# EasyEDA schematic SCH_rocket_competetion_2025-11-04.json
TITLE: IN-SPACe Rocket Schematic; REV: 1.0; Date: 2025-08-19; Sheet: 1/1; Drawn By: Riya; Company: TEAM SUDARSHAN
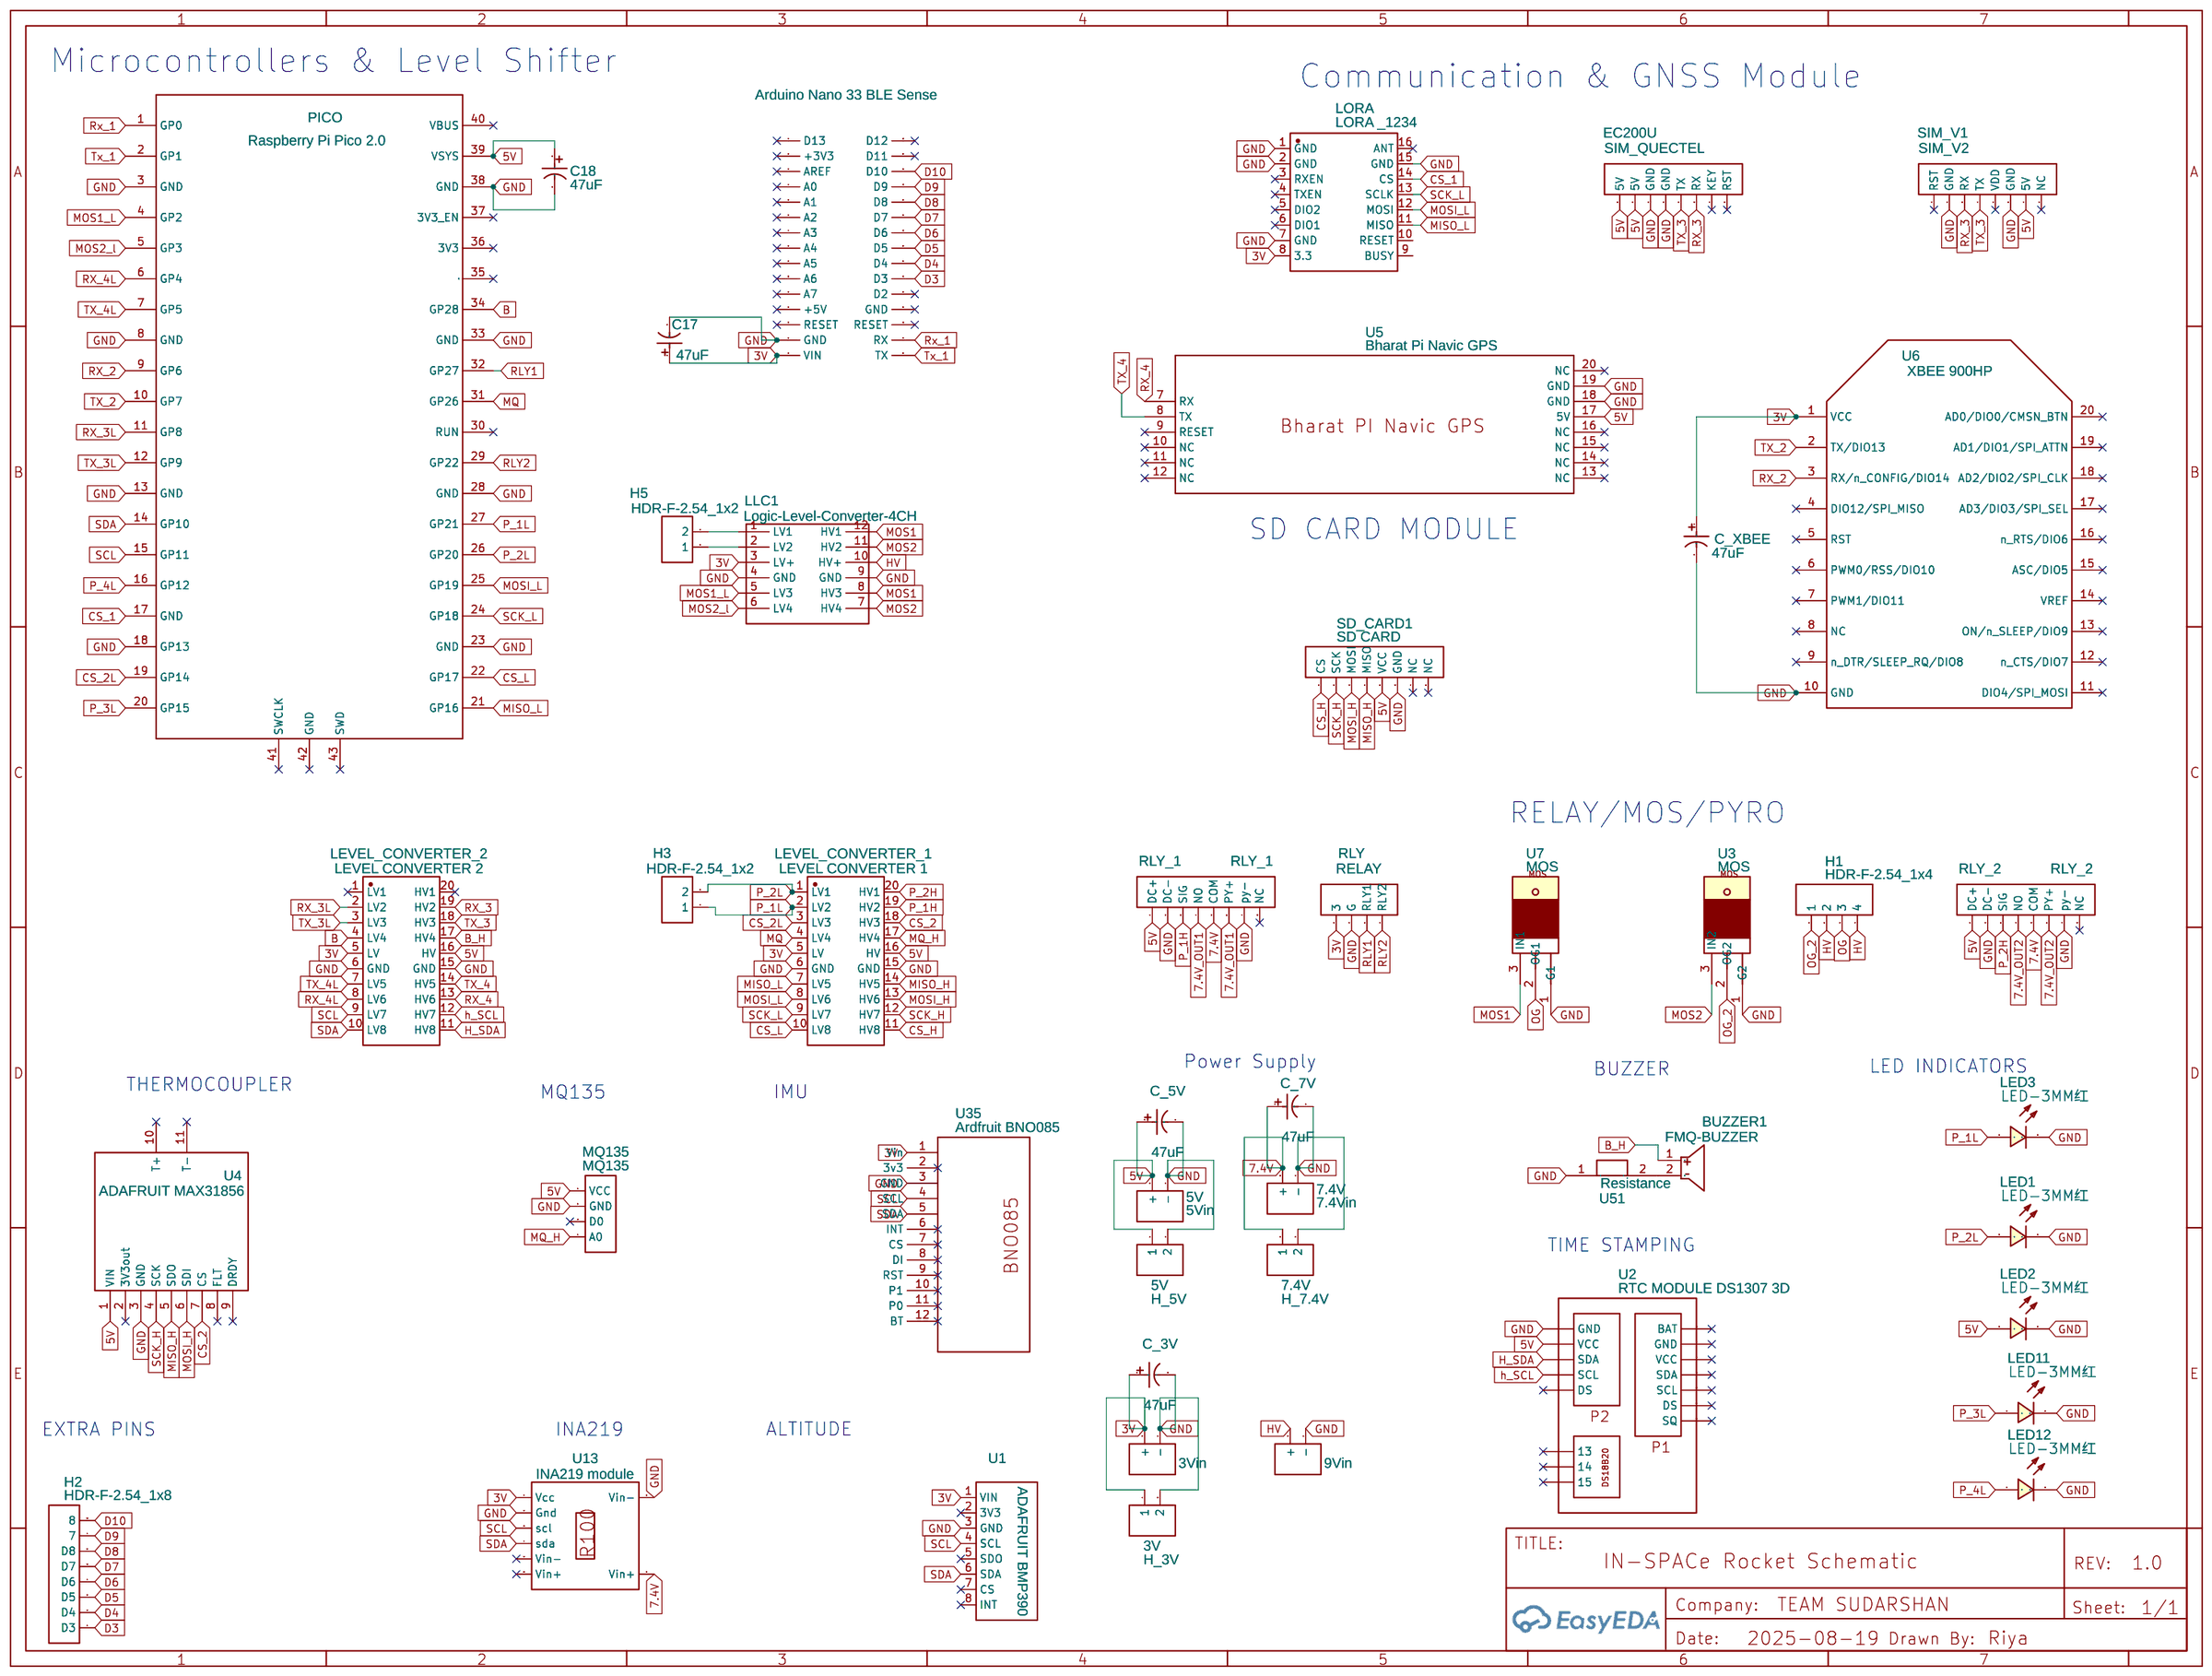
[diagram p0: schematic sheet]

## Parts
3.3V  3Vin  [CONN-TH_2P-P5.00]
5V  5Vin  [CONN-TH_2P-P5.00]
7.4V  7.4Vin  [CONN-TH_2P-P5.00]
9V  9Vin  [CONN-TH_2P-P5.00]
BLE33  Arduino Nano 33 BLE Sense  [ARDUINO_NANO_33_BLE_SENSE]
BUZZER1  FMQ-BUZZER  [BUZ-TH_BD12.0-P7.60-D0.6-FD]
C17  47uF  [CAPACITOR, 100UF 2.54MM PIN CAPACITOR]
C18  47uF  [CAPACITOR, 100UF 2.54MM PIN CAPACITOR]
C_3V  47uF  [CAPACITOR, 100UF 2.54MM PIN CAPACITOR]
C_5V  47uF  [CAPACITOR, 100UF 2.54MM PIN CAPACITOR]
C_7V  47uF  [CAPACITOR, 100UF 2.54MM PIN CAPACITOR]
C_XBEE  47uF  [CAPACITOR, 100UF 2.54MM PIN CAPACITOR]
EC200U  SIM_QUECTEL  [HDR-F-2.54_1X8]
H1  HDR-F-2.54_1x4  [HDR-F-2.54_1X4]
H2  HDR-F-2.54_1x8  [HDR-F-2.54_1X8]
H3  HDR-F-2.54_1x2  [HDR-F-2.54_1X2]
H5  HDR-F-2.54_1x2  [HDR-F-2.54_1X2]
H_3V  3V  [HDR-F-2.54_1X2]
H_5V  5V  [HDR-F-2.54_1X2]
H_7.4V  7.4V  [HDR-F-2.54_1X2]
LED1  LED-3MM红  [LED-TH_LED-3MM_RED]
LED2  LED-3MM红  [LED-TH_LED-3MM_RED]
LED3  LED-3MM红  [LED-TH_LED-3MM_RED]
LED11  LED-3MM红  [LED-TH_LED-3MM_RED]
LED12  LED-3MM红  [LED-TH_LED-3MM_RED]
LEVEL_CONVERTER_1  LEVEL CONVERTER 1  [MPN-TH-20_L28.0-W14.0-P2.54-BL]
LEVEL_CONVERTER_2  LEVEL CONVERTER 2  [MPN-TH-20_L28.0-W14.0-P2.54-BL]
LLC1  Logic-Level-Converter-4CH  [LOGIC-LEVEL-CONVERTER-4CH]
LORA  LORA _1234  [LORA_SX1262]
MQ135  MQ135  [HDR-F-2.54_1X4]
PICO  Raspberry Pi Pico 2.0  [PICO_FOOTPRINT_BY_HIMESH 2.0]
RLY  RELAY  [HDR-F-2.54_1X4]
RLY_1  RLY_1  [HDR-F-2.54_1X8]
RLY_2  RLY_2  [HDR-F-2.54_1X8]
SD_CARD1  SD CARD  [HDR-F-2.54_1X8]
SIM_V1  SIM_V2  [HDR-F-2.54_1X8]
U1  ADAFRUIT BMP390  [ADAFRUIT BMP390 NO HOLES]
U2  RTC MODULE DS1307 3D  [FP_RTC-MODULE-DS1307]
U3  MOS  [MOSFETIR540]
U4  ADAFRUIT MAX31856  [ADAFRUIT_MAX31856_BREAKOUT]
U5  Bharat Pi Navic GPS  [BHARAT PI NAVIC GPS]
U6  XBEE 900HP  [XBEE_PRO_S2C_THT]
U7  MOS  [MOSFETIR540]
U13  INA219 module  [INA219]
U35  Ardfruit BNO085  [ADAFRUIT-BNO085]
U51  Resistance  [RESISTANCE]

## Library data of the parts
3.3V 5V 7.4V 9V = CONN-TH_2P-P5.00: Supplier: LCSC; Contributor: LCEDA_Lib
BLE33 = Arduino Nano 33 BLE Sense: Contributor: thomas.ragos
BUZZER1 = FMQ-BUZZER2: Contributor: LCSC; Supplier: LCSC; Supplier Part: C9900006103; JLCPCB Part Class: Extended Part; Manufacturer: null
C17 C18 C_3V C_5V C_7V C_XBEE = CAPACITOR COPY: Manufacturer: CX(承兴); Manufacturer Part: KM476M016D11RR0VH2FP0; JLCPCB Part Class: Extended Part; Contributor: bilal3359
EC200U H2 RLY_1 RLY_2 SD_CARD1 SIM_V1 = HDR-F-2.54_1x8: Supplier Part: C225505; Supplier: LCSC; Contributor: LCEDA_Lib
H1 MQ135 RLY = HDR-F-2.54_1x4: Supplier Part: C225501; Supplier: LCSC; Contributor: LCEDA_Lib
H3 H5 H_3V H_5V H_7.4V = HDR-F-2.54_1x2: Supplier Part: C49661; Supplier: LCSC; Contributor: LCEDA_Lib
LED1-LED3 LED11 LED12 = LED-3MM红: Contributor: LCSC; Supplier: LCSC; Supplier Part: C9900003389; Manufacturer Part: LED-3mm红; Manufacturer: null; JLCPCB Part Class: Extended Part
LEVEL_CONVERTER_1 LEVEL_CONVERTER_2 = LEVEL CONVERTER 8: Contributor: LCSC; Supplier: LCSC; Supplier Part: C2829587; Manufacturer: null; Manufacturer Part: Level Converter 8; JLCPCB Part Class: Extended Part
LLC1 = Logic-Level-Converter-4CH: Supplier Part: 50807; Supplier: Космодром; Contributor: Олег Мошник
LORA = LORA _1234: Contributor: psrinivasu biomimicry; Supplier: Digi-Key; Supplier Part: C9900000331; Manufacturer: null; JLCPCB Part Class: Extended Part
PICO = Raspberry Pi Pico 2.0: Manufacturer Part: Raspberry Pi Pico; Contributor: bradc37
U1 = ADAFRUIT BMP390 COPY: Manufacturer Part: ADAFRUIT; Contributor: tomasw5011
U2 = RTC MODULE DS1307 3D: Contributor: viniciusantunes
U3 U7 = MOS: Contributor: ss.samsung86
U4 = ADAFRUIT MAX31856: Manufacturer Part: ADAFRUIT; link: https://learn.adafruit.com/adafruit-max31856-thermocouple-amplifier; Contributor: Elec Lab
U5 = Bharat Pi Navic GPS: Contributor: lavitrasahu123
U6 = XBEE_THT: Manufacturer: Digi International; Manufacturer Part: XBP24CZ7PITB003; Supplier: Digi-Key; Supplier Part: 602-1859-ND; link: https://www.digikey.com/product-detail/en/digi-international/XBP24CZ7PITB003/602-1859-ND/5322881?WT.z_cid=ref_neda_dkc_buynow_digiintl&utm_source=ecia&utm_medium=aggregator&utm_campaign=digiintl; Contributor: jorge.caicedo.martinez
U13 = INA219 module: Manufacturer: TI; link: https://www.ti.com/lit/ds/symlink/ina219.pdf; Contributor: zebrajaeger
U35 = Ardfruit BNO085: Manufacturer: Ardfruit; Contributor: 01Test001
U51 = Resistance: Contributor: williamlalis00

## Nets
3V: 3.3V.2(+) BLE33.15(VIN) C17.1 C_3V.1 C_XBEE.1 H_3V.1 LEVEL_CONVERTER_1.5(LV) LEVEL_CONVERTER_2.5(LV) LLC1.3(LV+) LORA.8(3.3) RLY.1(3) U1.1(VIN) U6.1(VCC) U13.1(Vcc) U35.1(Vin)
5V: 5V.2(+) C18.1 C_5V.1 EC200U.1(5V) EC200U.2(5V) H_5V.1 LED2.1 LEVEL_CONVERTER_1.16(HV) LEVEL_CONVERTER_2.16(HV) MQ135.1(VCC) PICO.39(VSYS) RLY_1.1(DC+) RLY_2.1(DC+) SD_CARD1.5(VCC) SIM_V1.7(5V) U2.2(VCC) U4.1(VIN) U5.17(5V)
7.4V: 7.4V.2(+) C_7V.1 H_7.4V.1 RLY_1.5(COM) RLY_2.5(COM) U13.6(Vin+)
7.4V_OUT1: RLY_1.4(NO) RLY_1.6(PY+)
7.4V_OUT2: RLY_2.4(NO) RLY_2.6(PY+)
GND: 3.3V.1(-) 5V.1(-) 7.4V.1(-) 9V.1(-) BLE33.14(GND) C17.2 C18.2 C_3V.2 C_5V.2 C_7V.2 C_XBEE.2 EC200U.3(GND) EC200U.4(GND) H_3V.2 H_5V.2 H_7.4V.2 LED1.2 LED2.2 LED3.2 LED11.2 LED12.2 LEVEL_CONVERTER_1.6(GND) LEVEL_CONVERTER_1.15(GND) LEVEL_CONVERTER_2.6(GND) LEVEL_CONVERTER_2.15(GND) LLC1.4(GND) LLC1.9(GND) LORA.1(GND) LORA.2(GND) LORA.7(GND) LORA.15(GND) MQ135.2(GND) PICO.3(GND) PICO.8(GND) PICO.13(GND) PICO.18(GP13) PICO.23(GND) PICO.28(GND) PICO.33(GND) PICO.38(GND) RLY.2(G) RLY_1.2(DC-) RLY_1.7(py-) RLY_2.2(DC-) RLY_2.7(py-) SD_CARD1.6(GND) SIM_V1.2(GND) SIM_V1.6(GND) U1.3(GND) U2.1(GND) U3.1(G2) U4.3(GND) U5.18(GND) U5.19(GND) U6.10(GND) U7.1(G1) U13.2(Gnd) U13.5(Vin-) U35.3(GND) U51.1
B: LEVEL_CONVERTER_2.4(LV4) PICO.34(GP28)
B_H: BUZZER1.1 LEVEL_CONVERTER_2.17(HV4)
CS_1: LORA.14(CS) PICO.17(GND)
CS_2: LEVEL_CONVERTER_1.18(HV3) U4.7(CS)
CS_2L: LEVEL_CONVERTER_1.3(LV3) PICO.19(GP14)
CS_H: LEVEL_CONVERTER_1.11(HV8) SD_CARD1.1(CS)
CS_L: LEVEL_CONVERTER_1.10(LV8) PICO.22(GP17)
D3: BLE33.21(D3) H2.1(D3)
D4: BLE33.22(D4) H2.2(D4)
D5: BLE33.23(D5) H2.3(D5)
D6: BLE33.24(D6) H2.4(D6)
D7: BLE33.25(D7) H2.5(D7)
D8: BLE33.26(D8) H2.6(D8)
D9: BLE33.27(D9) H2.7
D10: BLE33.28(D10) H2.8
h_SCL: LEVEL_CONVERTER_2.12(HV7) U2.4(SCL)
H_SDA: LEVEL_CONVERTER_2.11(HV8) U2.3(SDA)
HV: 9V.2(+) H1.2 H1.4 LLC1.10(HV+)
MISO_H: LEVEL_CONVERTER_1.14(HV5) SD_CARD1.4(MISO) U4.5(SDO)
MISO_L: LEVEL_CONVERTER_1.7(LV5) LORA.11(MISO) PICO.21(GP16)
MOS1: LLC1.8(HV3) LLC1.12(HV1) U7.3(IN1)
MOS1_L: LLC1.5(LV3) PICO.4(GP2)
MOS2: LLC1.7(HV4) LLC1.11(HV2) U3.3(IN2)
MOS2_l: LLC1.6(LV4) PICO.5(GP3)
MOSI_H: LEVEL_CONVERTER_1.13(HV6) SD_CARD1.3(MOSI) U4.6(SDI)
MOSI_L: LEVEL_CONVERTER_1.8(LV6) LORA.12(MOSI) PICO.25(GP19)
MQ: LEVEL_CONVERTER_1.4(LV4) PICO.31(GP26)
MQ_H: LEVEL_CONVERTER_1.17(HV4) MQ135.4(A0)
OG: H1.3 U7.2(OG1)
OG_2: H1.1 U3.2(OG2)
P_1H: LEVEL_CONVERTER_1.19(HV2) RLY_1.3(SIG)
P_1L: H3.1 LED3.1 LEVEL_CONVERTER_1.2(LV2) PICO.27(GP21)
P_2H: LEVEL_CONVERTER_1.20(HV1) RLY_2.3(SIG)
P_2L: H3.2 LED1.1 LEVEL_CONVERTER_1.1(LV1) PICO.26(GP20)
P_3L: LED11.1 PICO.20(GP15)
P_4L: LED12.1 PICO.16(GP12)
RLY1: PICO.32(GP27) RLY.3(RLY1)
RLY2: PICO.29(GP22) RLY.4(RLY2)
Rx_1: BLE33.17(RX) PICO.1(GP0)
RX_2: PICO.9(GP6) U6.3(RX/n_CONFIG/DIO14)
RX_3: EC200U.6(RX) LEVEL_CONVERTER_2.19(HV2) SIM_V1.3(RX)
RX_3L: LEVEL_CONVERTER_2.2(LV2) PICO.11(GP8)
RX_4: LEVEL_CONVERTER_2.13(HV6) U5.7(RX)
RX_4L: LEVEL_CONVERTER_2.8(LV6) PICO.6(GP4)
SCK_H: LEVEL_CONVERTER_1.12(HV7) SD_CARD1.2(SCK) U4.4(SCK)
SCK_L: LEVEL_CONVERTER_1.9(LV7) LORA.13(SCLK) PICO.24(GP18)
SCL: LEVEL_CONVERTER_2.9(LV7) PICO.15(GP11) U1.4(SCL) U13.3(scl) U35.4(SCL)
SDA: LEVEL_CONVERTER_2.10(LV8) PICO.14(GP10) U1.6(SDA) U13.4(sda) U35.5(SDA)
Tx_1: BLE33.16(TX) PICO.2(GP1)
TX_2: PICO.10(GP7) U6.2(TX/DIO13)
TX_3: EC200U.5(TX) LEVEL_CONVERTER_2.18(HV3) SIM_V1.4(TX)
TX_3L: LEVEL_CONVERTER_2.3(LV3) PICO.12(GP9)
TX_4: LEVEL_CONVERTER_2.14(HV5) U5.8(TX)
TX_4L: LEVEL_CONVERTER_2.7(LV5) PICO.7(GP5)
Net-(BUZZER1-2): BUZZER1.2 U51.2
Net-(H5-1): H5.1 LLC1.2(LV2)
Net-(H5-2): H5.2 LLC1.1(LV1)

Not connected (* = marked no-connect by the designer): BLE33 1(D13)* 2(+3V3)* 3(AREF)* 4(A0)* 5(A1)* 6(A2)* 7(A3)* 8(A4)* 9(A5)* 10(A6)* 11(A7)* 12(+5V)* 13(RESET)* 18(RESET)* 19(GND)* 20(D2)* 29(D11)* 30(D12)*; EC200U 7(KEY)* 8(RST)*; LEVEL_CONVERTER_2 1(LV1)* 20(HV1)*; LORA 3(RXEN)* 4(TXEN)* 5(DIO2)* 6(DIO1)* 9(BUSY) 10(RESET) 16(ANT)*; MQ135 3(D0)*; PICO 30(RUN)* 35* 36(3V3)* 37(3V3_EN)* 40(VBUS)* 41(SWCLK)* 42(GND)* 43(SWD)*; RLY_1 8(NC)*; RLY_2 8(NC)*; SD_CARD1 7(NC)* 8(NC)*; SIM_V1 1(RST)* 5(VDD)* 8(NC)*; U1 2(3V3)* 5(SDO)* 7(CS)* 8(INT)*; U2 5(DS)* 6(BAT)* 7(GND)* 8(VCC)* 9(SDA)* 10(SCL)* 11(DS)* 12(SQ)* 13* 14* 15*; U4 2(3V3out)* 8(FLT)* 9(DRDY)* 10(T+)* 11(T-)*; U5 9(RESET)* 10(NC)* 11(NC)* 12(NC)* 13(NC)* 14(NC)* 15(NC)* 16(NC)* 20(NC)*; U6 4(DIO12/SPI_MISO)* 5(RST)* 6(PWM0/RSS/DIO10)* 7(PWM1/DIO11)* 8(NC)* 9(n_DTR/SLEEP_RQ/DIO8)* 11(DIO4/SPI_MOSI)* 12(n_CTS/DIO7)* 13(ON/n_SLEEP/DIO9)* 14(VREF)* 15(ASC/DIO5)* 16(n_RTS/DIO6)* 17(AD3/DIO3/SPI_SEL)* 18(AD2/DIO2/SPI_CLK)* 19(AD1/DIO1/SPI_ATTN)* 20(AD0/DIO0/CMSN_BTN)*; U35 2(3v3)* 6(INT)* 7(CS)* 8(DI)* 9(RST)* 10(P1)* 11(P0)* 12(BT)*

## Notes on the sheet
- Microcontrollers & Level Shifter
- Communication & GNSS Module
- SD CARD MODULE
- RELAY/MOS/PYRO
- Power Supply
- BUZZER
- LED INDICATORS
- THERMOCOUPLER
- MQ135
- IMU
- TIME STAMPING
- EXTRA PINS
- INA219
- ALTITUDE
